# EAGLE design untitled (EAGLE 9.5.2)
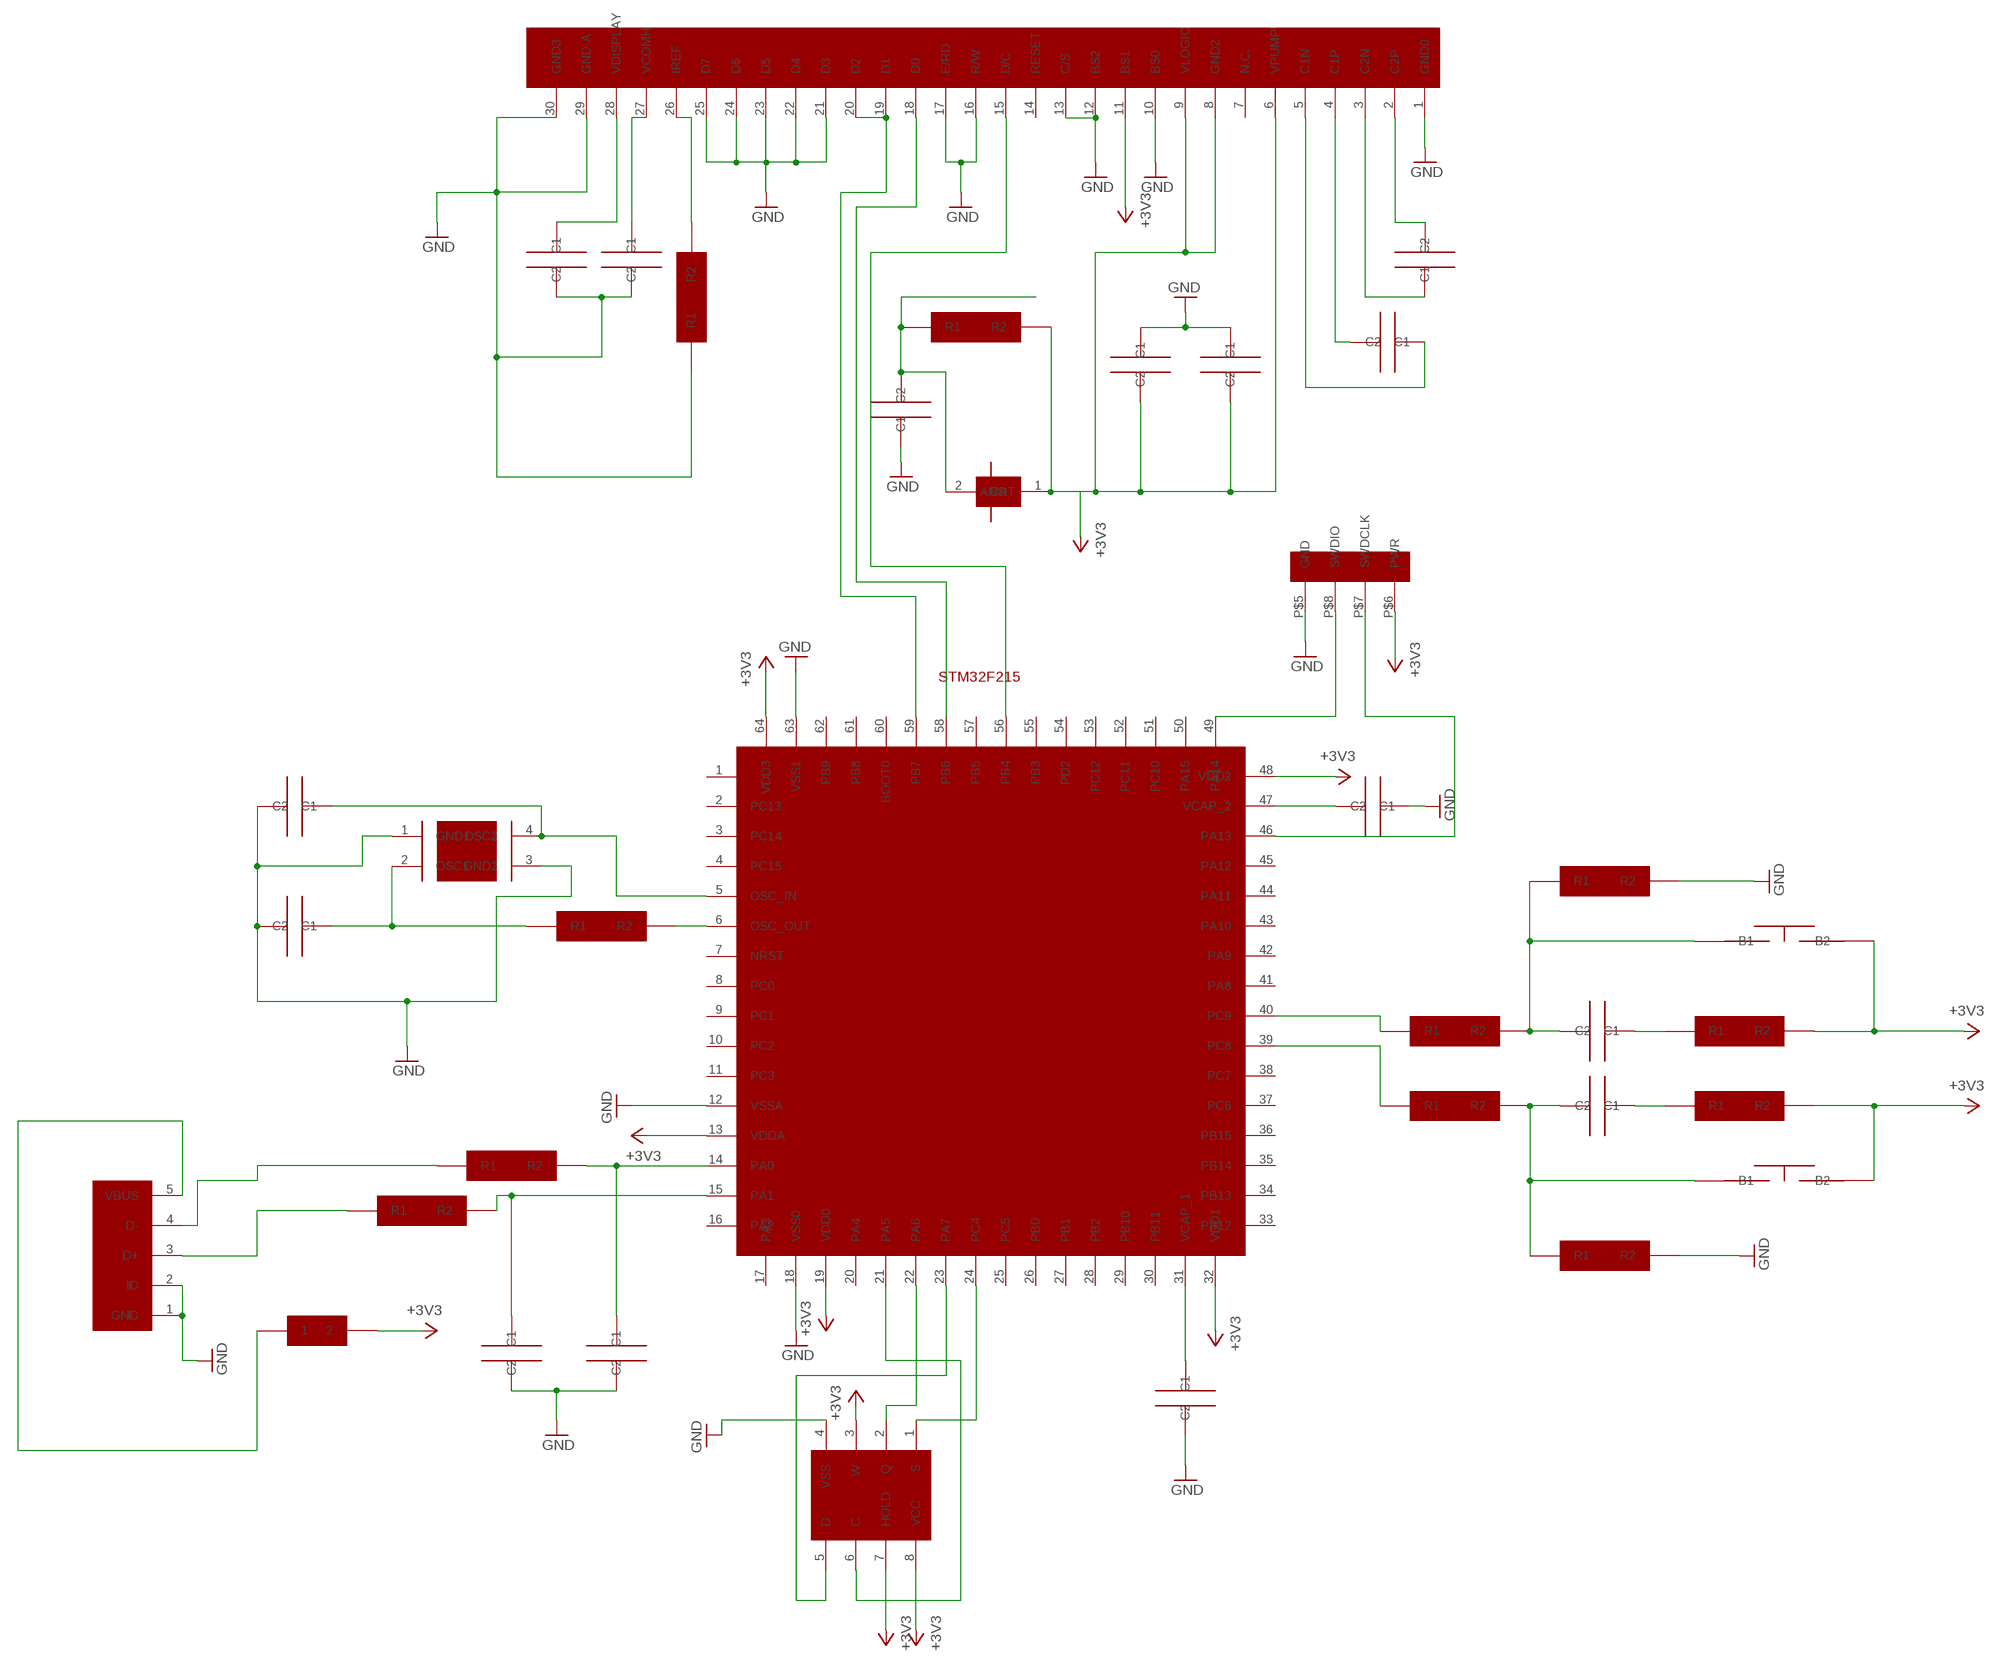
[diagram p0: schematic, sheet 1]

## Parts
C10  100нф  C0805  [0805]
C11  100нф  C0805  [0805]
C28  8пф  C0805  [0805]
C29  8пф  C0805  [0805]
C30  47пф  C0805  [0805]
C31  47пф  C0805  [0805]
C36  2.2мкф  C0805  [0805]
C37  2.2мкф  C0805  [0805]
C39  1мкф  C0805  [0805]
C40  1мкф  C0805  [0805]
C41  1мкф  C0805  [0805]
C42  1мкф  C0805  [0805]
C44  4.7мкф  C0805  [0805]
C46  2.2мкф  C0805  [0805]
C47  4.7мкф  C0805  [0805]
R2  330  R0805  [0805]
R3  330  R0805  [0805]
R6  100  R0805  [0805]
R7  100  R0805  [0805]
R14  220k  R0805  [0805]
R15  220k  R0805  [0805]
R32  820  R0805  [0805]
R33  22  R0805  [0805]
R34  22  R0805  [0805]
R43  4.7к  R0805  [0805]
R48  910к  R0805  [0805]
U$1  STM32F215RE  [QFP64]
U$18  BUTTON  [BUTTON]
U$19  BUTTON  [BUTTON]
U$26  NX2520SA  [NX2520SA]
U$27  MEMORYMEMORY2  [SOIC127P600X175-8N]
U$35  STABILITRON_3.3VSTABILITRON_SMD  [DIOC3314X145N]
U$38  SSD1306  [SSD1306]
U$45  ESD  [ESD]
U$49  SWD  [SWD]
U$50  USB  [USB]

## Nets
+3V3: C41.1(C1) C42.1(C1) R6.2(R2) R7.2(R2) R43.2(R2) U$1.13(VDDA) U$1.19(VDD0) U$1.32(VDD1) U$1.48(VDD2) U$1.64(VDD3) U$18.2(B2) U$19.2(B2) U$27.3(W) U$27.7(HOLD) U$27.8(VCC) U$35.2 U$38.6(VPUMP) U$38.8(GND2) U$38.9(VLOGIC) U$38.11(BS1) U$45.1(ANO) U$49.P$6(PWR)
GND: C28.1(C1) C29.1(C1) C30.1(C1) C31.1(C1) C36.1(C1) C37.2(C2) C41.2(C2) C42.2(C2) C44.2(C2) C46.1(C1) C47.1(C1) R14.2(R2) R15.2(R2) R48.1(R1) U$1.12(VSSA) U$1.18(VSS0) U$1.63(VSS1) U$26.1(GND1) U$26.3(GND2) U$27.4(VSS) U$38.1(GND0) U$38.10(BS0) U$38.12(BS2) U$38.13(C/S) U$38.16(R/W) U$38.17(E/RD) U$38.21(D3) U$38.22(D4) U$38.23(D5) U$38.24(D6) U$38.25(D7) U$38.29(GND-A) U$38.30(GND3) U$49.P$5(GND) U$50.1(GND) U$50.2(ID)
N$5: C11.1(C1) R3.2(R2) R15.1(R1) U$19.1(B1)
N$6: C11.2(C2) R7.1(R1)
N$7: C10.1(C1) R2.2(R2) R14.1(R1) U$18.1(B1)
N$8: C10.2(C2) R6.1(R1)
N$17: R32.2(R2) U$1.6(OSC_OUT)
N$18: C28.2(C2) U$1.5(OSC_IN) U$26.4(OSC2)
N$19: C29.2(C2) R32.1(R1) U$26.2(OSC1)
N$20: C30.2(C2) R33.2(R2) U$1.14(PA0)
N$21: C31.2(C2) R34.2(R2) U$1.15(PA1)
N$22: C36.2(C2) U$1.31(VCAP_1)
N$23: R33.1(R1) U$50.4(D-)
N$24: R34.1(R1) U$50.3(D+)
N$25: C37.1(C1) U$1.47(VCAP_2)
N$28: R3.1(R1) U$1.39(PC8)
N$29: R2.1(R1) U$1.40(PC9)
N$30: U$1.24(PC4) U$27.1(S)
N$31: U$1.22(PA6) U$27.2(Q)
N$32: U$1.21(PA5) U$27.6(C)
N$33: U$1.23(PA7) U$27.5(D)
N$34: C39.1(C1) U$38.2(C2P)
N$35: C39.2(C2) U$38.3(C2N)
N$36: C40.1(C1) U$38.4(C1P)
N$37: C40.2(C2) U$38.5(C1N)
N$38: C44.1(C1) R43.1(R1) U$45.2(CAT)
N$40: U$35.1 U$50.5(VBUS)
N$43: R48.2(R2) U$38.26(IREF)
N$44: C47.2(C2) U$38.27(VCOMH)
N$45: C46.2(C2) U$38.28(VDISPLAY)
N$47: U$1.59(PB7) U$38.19(D1) U$38.20(D2)
N$48: U$1.58(PB6) U$38.18(D0)
N$49: U$1.56(PB4) U$38.15(D/C)
N$51: U$1.49(PA14) U$49.P$8(SWDIO)
N$52: U$1.46(PA13) U$49.P$7(SWDCLK)
Unconnected: U$1.2(PC13) U$1.3(PC14) U$1.4(PC15) U$1.7(NRST) U$1.8(PC0) U$1.9(PC1) U$1.10(PC2) U$1.11(PC3) U$1.16(PA2) U$1.17(PA3) U$1.20(PA4) U$1.25(PC5) U$1.26(PB0) U$1.27(PB1) U$1.28(PB2) U$1.29(PB10) U$1.30(PB11) U$1.33(PB12) U$1.34(PB13) U$1.35(PB14) U$1.36(PB15) U$1.37(PC6) U$1.38(PC7) U$1.41(PA8) U$1.42(PA9) U$1.43(PA10) U$1.44(PA11) U$1.45(PA12) U$1.50(PA15) U$1.51(PC10) U$1.52(PC11) U$1.53(PC12) U$1.54(PD2) U$1.55(PB3) U$1.57(PB5) U$1.60(BOOT0) U$1.61(PB8) U$1.62(PB9) U$38.7(N.C.) U$38.14(RESET)

## Power pins joined to a net without a drawn wire
VBAT: U$1.1(VBAT)

## Library data of the parts
C10 C11 C28-C31 C36 C37 C39-C42 C44 C46 C47 = IDMLib:C0805
R2 R3 R6 R7 R14 R15 R32-R34 R43 R48 = IDMLib:R0805
U$1 = IDMLib:STM32F215RE
U$18 U$19 = IDMLib:BUTTON
U$26 = IDMLib:NX2520SA
U$27 = IDMLib:MEMORY
U$35 = IDMLib:STABILITRON_3.3V
U$38 = IDMLib:SSD1306
U$45 = IDMLib:ESD
U$49 = IDMLib:SWD
U$50 = IDMLib:USB

## Board
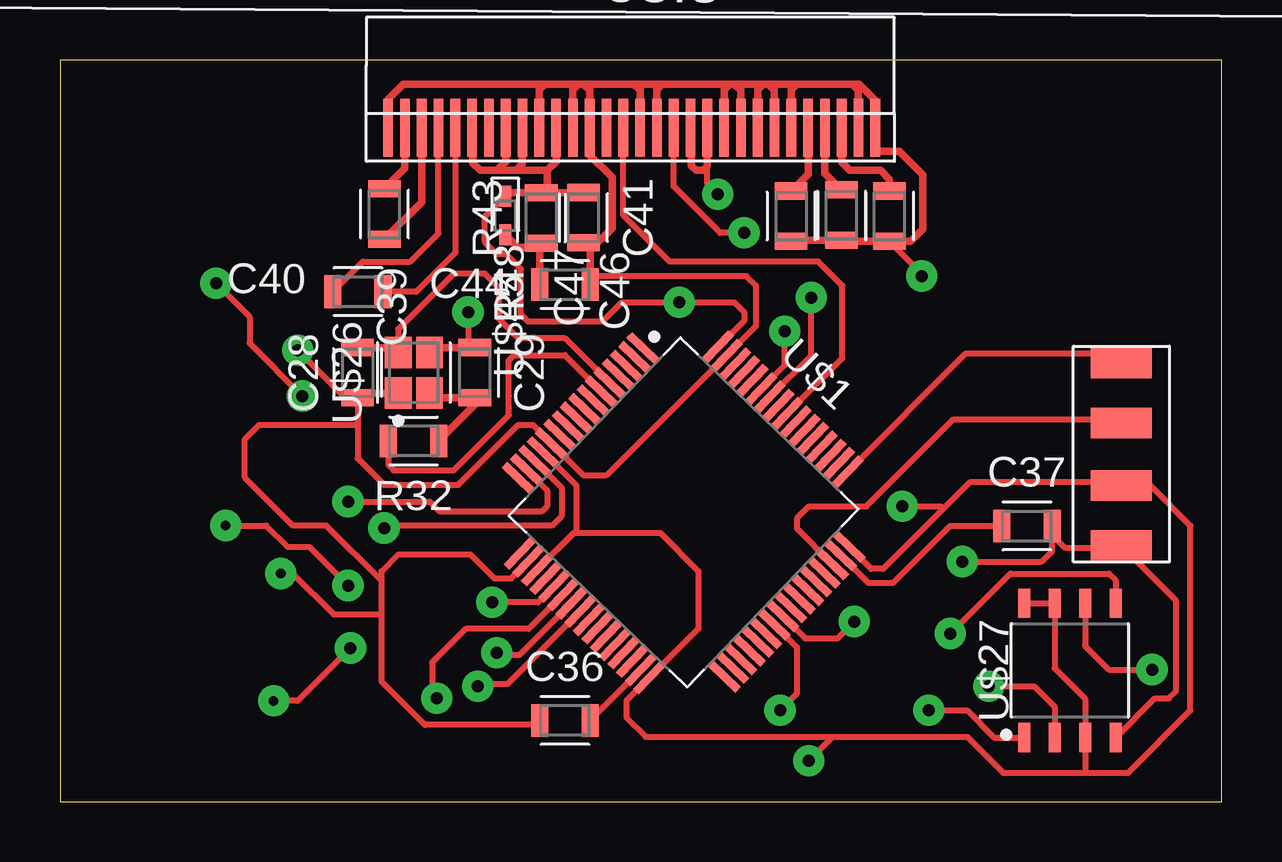
[diagram p1: board, top side]
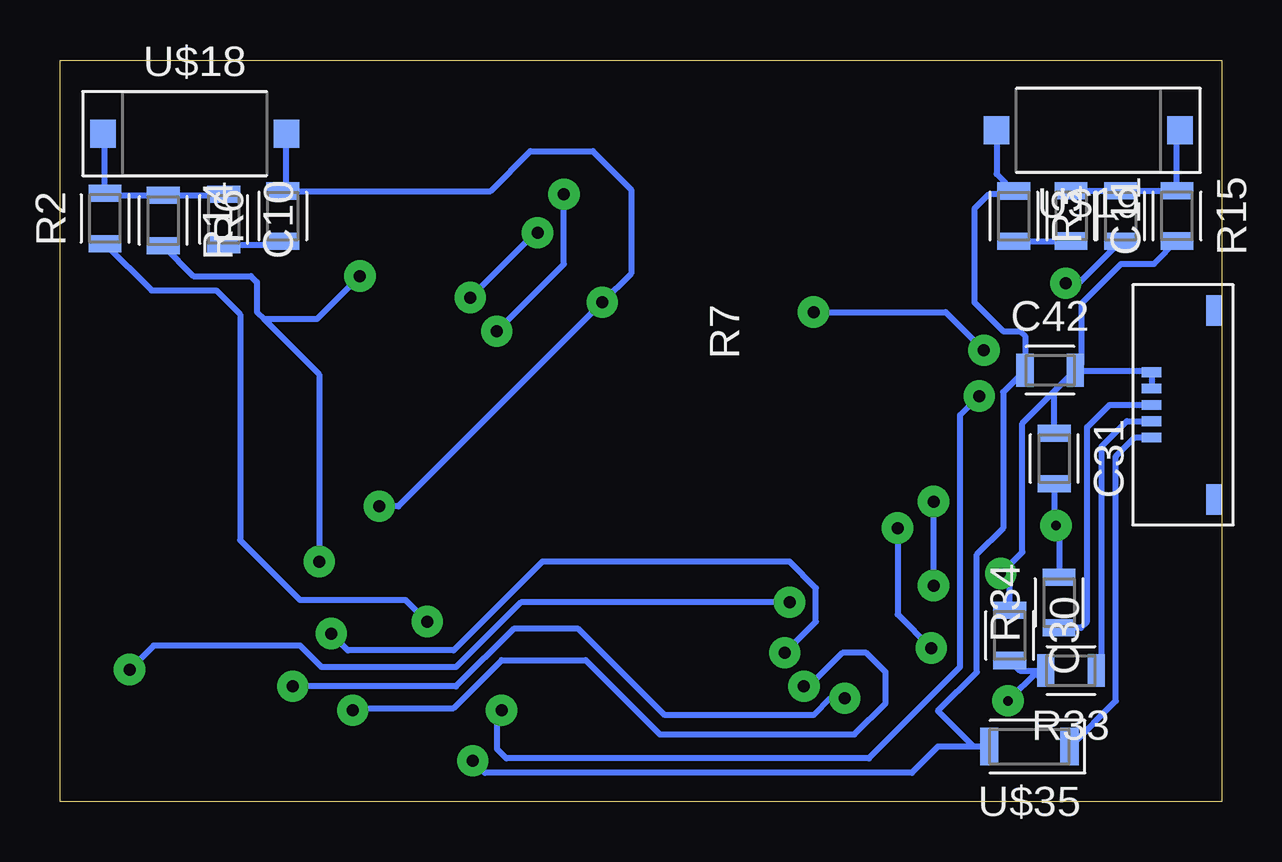
[diagram p2: board, bottom side, seen from below]

Size 48.4 x 30.9 mm. Coordinates in mm from the lower left corner, seen from the top.
Outline: 0,0 48.4,0 48.4,30.9 0,30.9 0,0
Copper layers (1*16): Top 0.035mm / dielectric 1.5mm / Bottom 0.035mm
Design rules "default": minimum track width 6mil, minimum drill 0.35mm, track to track 6mil, track to pad 6mil, pad to pad 6mil, via to via 6mil, smd to smd 6mil, copper to edge 40mil, drill to drill 6mil, minimum pad ring 10mil, minimum via ring 8mil, stop-mask expansion 4mil, vias tented up to drill 0mil, thermal gap 10mil

### Footprints (pad centres in the part's own frame; a part is rotated, then mirrored left to right if it is on the bottom)
0805 = smd 0.712 x 1.362: 1 -1.05,0; 2 1.05,0
QFP64 = smd 1.592 x 0.332: 1 -5.96,3.75; 2 -5.96,3.25; 3 -5.96,2.75; 4 -5.96,2.25; 5 -5.96,1.75; 6 -5.96,1.25; 7 -5.96,0.75; 8 -5.96,0.25; 9 -5.96,-0.25; 10 -5.96,-0.75; 11 -5.96,-1.25; 12 -5.96,-1.75; 13 -5.96,-2.25; 14 -5.96,-2.75; 15 -5.96,-3.25; 16 -5.96,-3.75; 33 5.96,-3.75; 34 5.96,-3.25; 35 5.96,-2.75; 36 5.96,-2.25; 37 5.96,-1.75; 38 5.96,-1.25; 39 5.96,-0.75; 40 5.96,-0.25; 41 5.96,0.25; 42 5.96,0.75; 43 5.96,1.25; 44 5.96,1.75; 45 5.96,2.25; 46 5.96,2.75; 47 5.96,3.25; 48 5.96,3.75 | smd 0.332 x 1.592: 17 -3.75,-5.96; 18 -3.25,-5.96; 19 -2.75,-5.96; 20 -2.25,-5.96; 21 -1.75,-5.96; 22 -1.25,-5.96; 23 -0.75,-5.96; 24 -0.25,-5.96; 25 0.25,-5.96; 26 0.75,-5.96; 27 1.25,-5.96; 28 1.75,-5.96; 29 2.25,-5.96; 30 2.75,-5.96; 31 3.25,-5.96; 32 3.75,-5.96; 49 3.75,5.96; 50 3.25,5.96; 51 2.75,5.96; 52 2.25,5.96; 53 1.75,5.96; 54 1.25,5.96; 55 0.75,5.96; 56 0.25,5.96; 57 -0.25,5.96; 58 -0.75,5.96; 59 -1.25,5.96; 60 -1.75,5.96; 61 -2.25,5.96; 62 -2.75,5.96; 63 -3.25,5.96; 64 -3.75,5.96
BUTTON = smd 1.062 x 1.172: 1 -3.825,0; 2 3.825,0
NX2520SA = smd 1.312 x 1.112: 1 -0.85,0.65; 2 -0.85,-0.65; 3 0.85,-0.65; 4 0.85,0.65
SOIC127P600X175-8N = smd 1.212 x 0.502: 1 -2.8,1.905; 2 -2.8,0.635; 3 -2.8,-0.635; 4 -2.8,-1.905; 5 2.8,-1.905; 6 2.8,-0.635; 7 2.8,0.635; 8 2.8,1.905
DIOC3314X145N = smd 0.762 x 1.562: 1 -1.675,0; 2 1.675,0
SSD1306 = smd 0.406 x 0.813: 1 -10.1,-0.4; 2 -9.4,-0.4; 3 -8.7,-0.4; 4 -8,-0.4; 5 -7.3,-0.4; 6 -6.6,-0.4; 7 -5.9,-0.4; 8 -5.2,-0.4; 9 -4.5,-0.4; 10 -3.8,-0.4; 11 -3.1,-0.4; 12 -2.4,-0.4; 13 -1.7,-0.4; 14 -1,-0.4; 15 -0.3,-0.4; 16 0.4,-0.4; 17 1.1,-0.4; 18 1.8,-0.4; 19 2.5,-0.4; 20 3.2,-0.4; 21 3.9,-0.4; 22 4.6,-0.4; 23 5.3,-0.4; 24 6,-0.4; 25 6.7,-0.4; 26 7.4,-0.4; 27 8.1,-0.4; 28 8.8,-0.4; 29 9.5,-0.4; 30 10.2,-0.4; P$1 -10.1,0.4; P$2 -9.4,0.4; P$3 -8.7,0.4; P$4 -8,0.4; P$5 -7.3,0.4; P$6 -6.6,0.4; P$7 -5.9,0.4; P$8 -5.2,0.4; P$9 -4.5,0.4; P$10 -3.8,0.4; P$11 -3.1,0.4; P$12 -2.4,0.4; P$13 -1.7,0.4; P$14 -1,0.4; P$15 -0.3,0.4; P$16 0.4,0.4; P$17 1.1,0.4; P$18 1.8,0.4; P$19 2.5,0.4; P$20 3.2,0.4; P$21 3.9,0.4; P$22 4.6,0.4; P$23 5.3,0.4; P$24 6,0.4; P$25 6.7,0.4; P$26 7.4,0.4; P$27 8.1,0.4; P$28 8.8,0.4; P$29 9.5,0.4; P$30 10.2,0.4; P$31 -10.1,1.2; P$32 -9.4,1.2; P$33 -8.7,1.2; P$34 -8,1.2; P$35 -7.3,1.2; P$36 -6.6,1.2; P$37 -5.9,1.2; P$38 -5.2,1.2; P$39 -4.5,1.2; P$40 -3.8,1.2; P$41 -3.1,1.2; P$42 -2.4,1.2; P$43 -1.7,1.2; P$44 -1,1.2; P$45 -0.3,1.2; P$46 0.4,1.2; P$47 1.1,1.2; P$48 1.8,1.2; P$49 2.5,1.2; P$50 3.2,1.2; P$51 3.9,1.2; P$52 4.6,1.2; P$53 5.3,1.2; P$54 6,1.2; P$55 6.7,1.2; P$56 7.4,1.2; P$57 8.1,1.2; P$58 8.8,1.2; P$59 9.5,1.2; P$60 10.2,1.2
ESD = smd 0.862 x 0.512: 1 -0.8,0; 2 0.8,0
SWD = smd 1.27 x 2.54: P$5 -3.8,0; P$6 -1.3,0; P$7 1.3,0; P$8 3.8,0
USB = smd 0.406 x 0.813: 1 0.641,-2.203; 2 1.321,-2.203; 3 2,-2.203; 4 2.679,-2.203; 5 3.359,-2.203 | smd 1.27 x 0.635: GND1 -1.94,0.378; GND2 5.94,0.378

### Placement (x,y rotation side)
C10  41.58,24.26 270 bottom
C11  6.27,24.41 270 bottom
C28  12.4,17.87 90 top
C29  17.28,17.87 270 top
C30  8.83,6.93 270 bottom
C31  6.97,14.29 270 bottom
C36  21.04,3.38 0 top
C37  40.29,11.48 0 top
C39  13.52,24.48 270 top
C40  12.41,21.24 0 top
C41  21.81,24.33 270 top
C42  7.14,17.97 0 bottom
C44  21.04,21.54 0 top
C46  34.56,24.39 90 top
C47  32.56,24.44 90 top
R2  46.53,24.3 90 bottom
R3  4.21,24.4 90 bottom
R6  39.12,24.39 90 bottom
R7  8.66,24.39 90 bottom
R14  44.1,24.21 270 bottom
R15  1.86,24.41 270 bottom
R32  14.73,15.03 180 top
R33  6.28,5.46 180 bottom
R34  6.77,8.29 90 bottom
R43  20.05,24.32 90 top
R48  30.46,24.39 90 top
U$1  25.99,12.05 316.1 top
U$18  42.79,27.83 0 bottom
U$19  5.55,27.97 180 bottom
U$26  14.74,17.87 90 top
U$27  42.08,5.47 90 top
U$35  8.01,2.29 180 bottom
U$38  23.77,27.68 0 top
U$45  18.55,24.42 270 top
U$49  44.22,14.48 90 top
U$50  0.71,18.53 270 bottom

### Tracks (layer width: path | path; a pad name or v marks a point on that pad's centre or on a via)
+3V3  (via drill 0.5 pad 1.3)
  Top 0.254: U$45.1 17.7,24.37 17.7,23.3 18.2,22.8 18.6,22.8 19.2,22.2 19.2,20.3 19.5,20 22.6,20 23.4,20.8 v25.8,20.8 28.1,20.8 28.5,20.4 28.5,20.03 U$1.64 | U$1.48 33.8,9.7 34.3,9.7 36.8,12.2 | U$1.13 21.49,13.2 21.5,13.2 21.5,11.29 U$1.19 21.41,11.2 25,11.2 26.6,9.6 26.6,7.2 U$1.32 23.6,4.2 23.6,3.5 24.4,2.7 32.2,2.7 | 42.8,1.2 39.3,1.2 37.8,2.7 32.2,2.7 | v35.1,12.3 36.7,12.3 36.8,12.2 | v31.2,1.7 32.2,2.7 | 42.8,1.2 44.5,1.2 47.1,3.8 47.1,11.5 45.42,13.18 44.4,13.18 | 42.8,1.2 42.72,1.29 U$27.3 42.72,4.29 41.44,5.55 U$27.7 U$27.8 | 44.4,13.18 U$49.P$6 44.2,13.3 37.9,13.3 36.8,12.2 | 44.38,13.2 44.4,13.18
  Top 0.305: U$38.6 17.2,27.25 17.2,26.6 17.5,26.3 18.2,26.3 | 18.2,26.3 18.57,26.67 U$38.8 | 18.2,26.3 19,26.3 | 19,26.3 19.27,26.57 U$38.9 | 20.3,26.3 20.67,26.67 U$38.11 | 19,26.3 20.3,26.3 | C41.1 R43.2 | R43.2 18.7,25.37 U$45.1 | R43.2 20.3,25.62 20.3,26.3
  Bottom 0.254: v35.1,12.3 34.3,12.3 v25.8,20.8 24.6,22 24.6,25.5 26.2,27.1 28.8,27.1 30.46,25.44 R6.2 38.98,25.58 38.98,27.84 | v31.2,1.7 30.7,1.2 12.91,1.2 11.82,2.29 10.33,2.29 | U$19.2 9.38,26.16 R7.2 8.8,25.3 9.7,25.3 10.3,24.7 10.3,20.8 9.1,19.6 8.4,19.6 8.19,19.39 C42.1 9.1,17.06 9.1,11.4 10.2,10.3 10.2,5.4 11.82,3.78 10.33,2.29 | U$35.2 10.33,2.29
  Bottom 0.305: 8.19,17.66 C42.1 | 9.36,27.95 U$19.2 | 38.98,27.84 U$18.2
GND  (via drill 0.4 pad 1.3, 0.5 pad 1.3)
  Top 0.254: 22.09,21.9 28.6,21.9 29,21.5 29,19.82 U$1.63 22.78,13.6 21.8,13.6 U$1.12 | 12.4,15.6 C28.1 11.88,16.82 v9.9,18.8 | 12.4,15.6 12.4,14.3 13.5,13.2 16.6,13.2 19.1,15.7 19.7,15.7 U$1.12 | U$1.12 | U$1.12 20.53,14.92 21.11,14.34 | C46.1 35.9,22 v35.9,21.9 | v37.6,10 40.9,10 41.34,10.44 41.34,11.1 | 41.34,11.1 C37.2 | v17,20.4 17,19.2 C29.1 | C36.1 19.81,3.2 15.2,3.2 13.4,5 13.4,7.8 | 13.4,7.8 13.4,9.2 | 13.4,9.2 13.4,9.6 14.1,10.3 17.1,10.3 18.1,9.3 18.8,9.3 U$1.18 | 13.4,9.2 11.1,11.5 9.7,11.5 7.7,13.5 7.7,15.1 8.3,15.7 12.3,15.7 12.4,15.6 | v9.2,9.5 9.7,9.5 11.4,7.8 13.4,7.8 | 41.34,11.1 41.86,10.58 44.12,10.58 U$49.P$5 44.32,10.55 | 44.32,10.55 44.7,10.1 | 44.32,10.55 46.5,8.38 46.5,4.6 46.2,4.3 45.61,4.3 U$27.4
  Top 0.305: U$38.1 13.67,29.27 14.3,29.9 20.2,29.9 | 20.2,29.9 21.6,29.9 | 21.6,29.9 21.8,29.9 | 21.8,29.9 23.9,29.9 | 23.9,29.9 25.1,29.9 | 25.1,29.9 27.9,29.9 | 27.9,29.9 28.1,29.9 | 28.1,29.9 29.3,29.9 | 29.3,29.9 29.5,29.9 | 29.5,29.9 30.7,29.9 | 30.7,29.9 33,29.9 | 33,29.9 33.3,29.9 33.97,29.23 U$38.30 34.15,27.1 34.97,27.1 35.95,26.12 35.95,23.85 35.44,23.34 C46.1 32.61,23.34 | U$38.10 19.97,29.67 20.2,29.9 | U$38.12 21.37,29.67 21.6,29.9 | 21.8,29.9 22.07,29.63 U$38.13 22.07,26.94 23,26.01 23,23.9 22.1,23 22.09,23 | U$38.16 24.17,29.63 23.9,29.9 | U$38.17 24.87,29.67 25.1,29.9 | U$38.21 27.67,29.67 27.9,29.9 | U$38.22 28.37,29.63 28.1,29.9 | U$38.24 29.77,29.63 29.5,29.9 | U$38.23 29.07,29.67 29.3,29.9 | U$38.25 30.47,29.67 30.7,29.9 | U$38.29 33.27,29.63 33,29.9 | 32.61,23.34 C47.1 30.51,23.39 R48.1 | 32.56,23.29 32.61,23.34 | C44.2 22.09,21.9 22.09,23 | 22.09,23 C41.2 | U$26.3 15.59,18.92 C29.1 17.68,18.92 | U$26.1 12.6,17.02 C28.1 | 41.4,11.54 C37.2
  Bottom 0.254: 39.9,20.1 40.2,20.4 40.2,21.65 40.45,21.9 42.84,21.9 R14.2 | v17,20.4 11.5,20.4 v9.9,18.8 | 6.97,17.09 8.3,15.76 8.3,10.4 v9.2,9.5 8.83,9.13 C30.1 | C31.1 6.97,17.09 | 6.97,17.09 6.13,17.93 | 6.13,17.93 C42.2 5.85,18.21 5.85,20.75 4.2,22.4 2.82,22.4 R15.2 | v35.9,21.9 37.7,20.1 39.9,20.1 | 39.9,20.1 37.6,17.8 v37.6,10 | U$50.2 U$50.1 2.95,17.93 6.13,17.93
N$5
  Bottom 0.254: C11.1 R3.2 R15.1 1.86,27.84 U$19.1
  Bottom 0.305: R3.2 4.24,25.48
N$6
  Bottom 0.254: R7.1 6.29,23.34 C11.2
N$7
  Bottom 0.254: U$18.1 46.53,27.75 R2.2 46.44,25.26 R14.1 41.63,25.26 C10.1
N$8
  Bottom 0.254: C10.2 39.25,23.21 R6.1
N$17
  Top 0.254: R32.2 13.68,14.02 13.9,13.8 16.4,13.8 18.7,16.1 18.7,16.4 18.7,16.9 18.7,18.4 18.9,18.6 21.04,18.6 U$1.6
N$18
  Top 0.254: U$26.4 14.09,19.69 16.4,22 17.7,22 18.3,21.4 18.3,20.1 19.1,19.3 21.05,19.3 U$1.5
  Top 0.305: C28.2 13.89,18.92 | 13.89,18.92 U$26.4 | 13.83,18.98 13.89,18.92
N$19
  Top 0.305: U$26.2 15.59,16.82 C29.2 17.28,16.53 R32.1
N$20  (via drill 0.4 pad 1.3, 0.5 pad 1.3)
  Top 0.254: U$1.14 20.9,13.09 20.9,11.9 20.5,11.5 13.6,11.5 v13.5,11.4 | v12.1,6.4 9.9,4.2 v8.9,4.2
  Bottom 0.254: v13.5,11.4 13.5,7.8 v12.1,6.4 | v8.9,4.2 7.64,5.46 R33.2 8.41,5.46 C30.2
  Bottom 0.305: R33.2 7.57,5.22
N$21  (via drill 0.4 pad 1.3, 0.5 pad 1.3)
  Top 0.254: U$1.15 20.3,12.98 20.3,12.3 20.1,12.1 15.8,12.1 15.4,12.5 v12,12.5 | v12,9 10.4,10.6 9.5,10.6 8.6,11.5 v6.9,11.5
  Bottom 0.254: v12,9 v12,12.5 | C31.2 6.97,11.57 v6.9,11.5 6.77,11.37 R34.2
N$22
  Top 0.254: C36.2 24.2,5.48 U$1.31
N$23
  Bottom 0.254: R33.1 5,5.69 5,14.8 3.95,15.85 U$50.4
N$24
  Bottom 0.254: U$50.3 4.67,16.53 5.6,15.6 5.6,7.5 5.86,7.24 R34.1
N$25
  Top 0.254: C37.1 37.08,11.48 34.7,9.1 33.69,9.1 U$1.47
  Top 0.305: C37.1 39.08,11.64
N$28  (via drill 0.5 pad 1.3)
  Top 0.254: v6.5,21.6 7.9,20.2 7.9,19.1 v10.1,16.9 | 30,7.1 29.76,7.34 U$1.39 30.7,6.44 30.7,4.5 v30,3.8
  Bottom 0.254: v10.1,16.9 10.9,16.1 10.9,5.6 14.7,1.8 29.8,1.8 30.2,2.2 30.2,3.6 v30,3.8 | R3.1 5.96,21.6 v6.5,21.6
N$29  (via drill 0.5 pad 1.3)
  Top 0.254: 30.34,7.5 U$1.40 31.04,6.8 32.4,6.8 v33.1,7.5
  Bottom 0.254: v33.1,7.5 34,8.4 38.4,8.4 40.9,10.9 40.9,20.3 41.9,21.3 44.58,21.3 R2.1
N$30  (via drill 0.5 pad 1.3)
  Top 0.254: U$1.24 18.64,4.9 17.5,4.9 v17.4,4.8 | v36.2,3.8 37.8,3.8 38.93,2.67 U$27.1
  Bottom 0.254: v36.2,3.8 36.2,3.9 32,3.9 30,5.9 26.5,5.9 23.4,2.8 15.3,2.8 14,4.1 14,5.4 14.8,6.2 15.8,6.2 17.2,4.8 v17.4,4.8
N$31  (via drill 0.5 pad 1.3)
  Top 0.254: U$1.22 19.53,7.2 16.9,7.2 15.5,5.8 15.5,4.5 v15.7,4.3 | v38.7,4.8 40.6,4.8 41.44,3.95 U$27.2
  Bottom 0.254: v15.7,4.3 16.3,4.3 17,3.6 23.2,3.6 26.8,7.2 29.5,7.2 31.9,4.8 v38.7,4.8
N$32  (via drill 0.5 pad 1.3)
  Top 0.254: U$1.21 19.92,8.3 v18,8.3 | U$27.6 42.72,6.52 42.7,6.5 43.7,5.5 v45.5,5.5
  Bottom 0.254: v18,8.3 29.2,8.3 31.9,5.6 37.5,5.6 38.4,6.5 44.5,6.5 v45.5,5.5
N$33  (via drill 0.5 pad 1.3)
  Top 0.254: U$1.23 19.14,6.1 18.3,6.1 v18.2,6.2 | U$27.5 43.98,9.22 43.7,9.5 39.6,9.5 v37.1,7
  Bottom 0.254: v18.2,6.2 16.9,7.5 16.9,8.9 18,10 28.3,10 32,6.3 36.4,6.3 v37.1,7
N$34
  Top 0.305: U$38.2 14.37,26.38 C39.1
N$35
  Top 0.305: C39.2 15.07,24.98 U$38.3
N$36
  Top 0.254: C40.1 12.62,22.5 14.6,22.5 15.77,23.67 U$38.4
N$37
  Top 0.254: U$38.5 16.47,22.87 14.84,21.24 C40.2
N$38
  Top 0.305: U$45.2 19.08,23.09 19.87,23.09 R43.1 19.99,23.21 C44.1
N$40
  Bottom 0.254: U$35.1 6.31,2.29 4.4,4.2 4.4,14.4 3.63,15.17 U$50.5
N$43
  Top 0.305: R48.2 31.17,26.15 U$38.26
N$44
  Top 0.305: U$38.27 31.87,26.18 C47.2
N$45
  Top 0.305: U$38.28 32.57,26.63 32.9,26.3 34.2,26.3 34.56,25.94 C46.2
N$47  (via drill 0.5 pad 1.3)
  Top 0.254: U$1.59 30.2,18.19 v30.2,19.6 | v27.4,25.3 26.97,25.73 U$38.20
  Top 0.305: U$38.19 26.3,27.25 26.3,26.5 26.5,26.3 26.8,26.3 26.97,26.47 U$38.20
  Bottom 0.254: v30.2,19.6 27.4,22.4 v27.4,25.3
N$48  (via drill 0.5 pad 1.3)
  Top 0.254: U$1.58 31.3,18.59 v31.3,21 | v28.5,23.7 27.5,23.7 25.57,25.63 U$38.18
  Bottom 0.254: v31.3,21 28.6,23.7 v28.5,23.7
N$49
  Top 0.254: U$1.56 32.6,18.47 32.6,21.5 31.6,22.5 25.4,22.5 23.47,24.43 U$38.15
N$51
  Top 0.254: 44.11,18.19 U$49.P$8 44.3,18.2 45,18.2 44.53,18.67 37.75,18.67 U$1.49
N$52
  Top 0.254: U$1.46 30.7,11.39 30.7,11.8 31.2,12.3 33.6,12.3 37.22,15.92 43.98,15.92 44.18,15.72 U$49.P$7